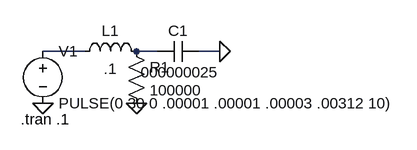
[diagram p0: schematic HornTankCircuit.asc]
HornTankCircuit.asc, the LTspice schematic file:
Version 4
SHEET 1 880 680
WIRE 48 112 -16 112
WIRE 160 112 128 112
WIRE 256 112 224 112
FLAG -16 192 0
FLAG 256 112 0
FLAG 128 192 0
SYMBOL ind 32 128 R270
WINDOW 0 32 56 VTop 2
WINDOW 3 5 56 VBottom 2
SYMATTR InstName L1
SYMATTR Value .1
SYMBOL cap 160 128 R270
WINDOW 0 32 32 VTop 2
WINDOW 3 0 32 VBottom 2
SYMATTR InstName C1
SYMATTR Value .000000025
SYMBOL voltage -16 96 R0
WINDOW 123 0 0 Left 2
WINDOW 39 0 0 Left 2
SYMATTR InstName V1
SYMATTR Value PULSE(0 30 0 .00001 .00001 .00003 .00312 10)
SYMBOL res 112 96 R0
SYMATTR InstName R1
SYMATTR Value 100000
TEXT -50 216 Left 2 !.tran .1

The netlist it stands for:
* HornTankCircuit.asc
L1 N001 N002 .1
C1 N002 0 .000000025
V1 N001 0 PULSE(0 30 0 .00001 .00001 .00003 .00312 10)
R1 N002 0 100000
.tran .1
.backanno
.end